# EAGLE design airspeed_drone_2 (EAGLE 7.7.0)
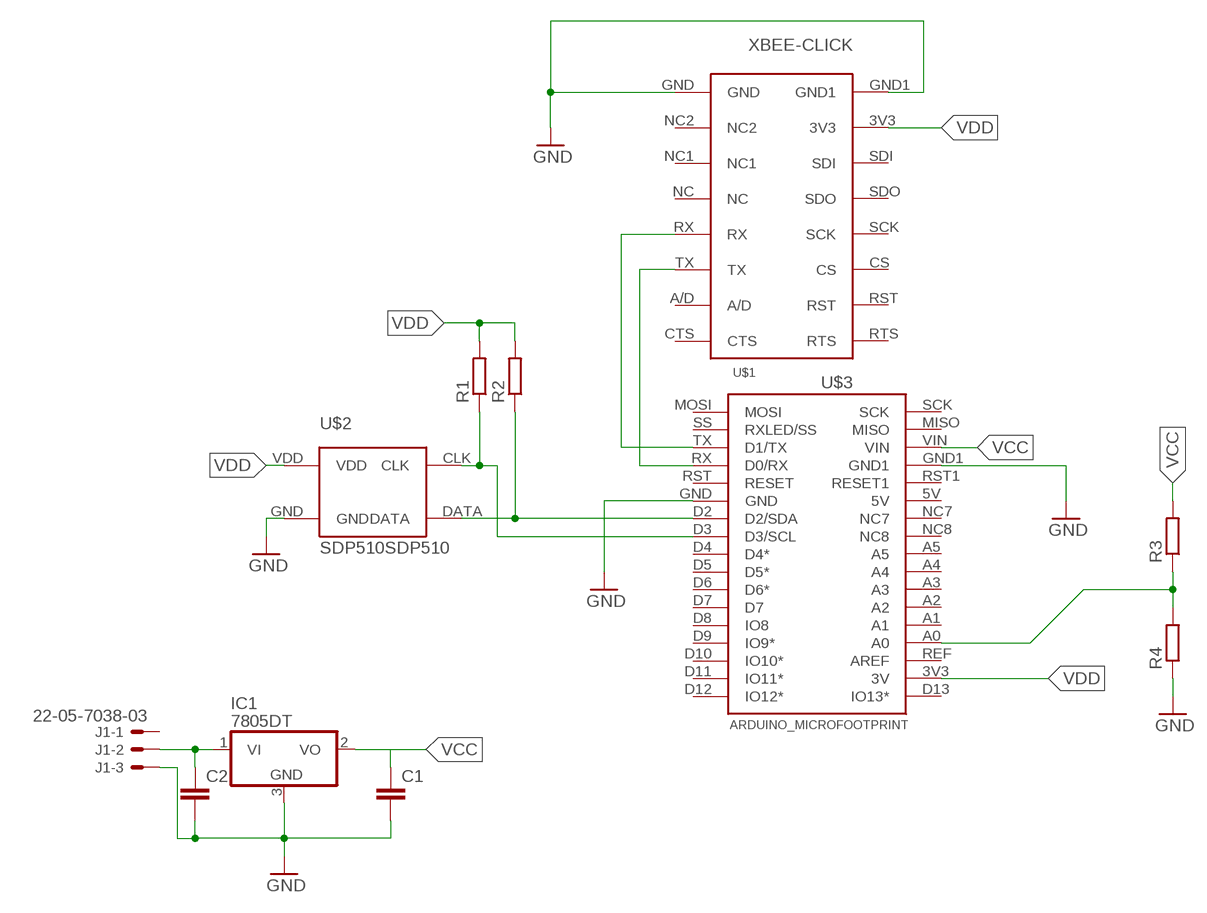
[diagram p0: schematic, sheet 1]

## Parts
C1  C-EUC0805K  [C0805K]
C2  C-EUC0805K  [C0805K]
IC1  7805DT  [TO252]
J1  22-05-7038-03  [7395-03]
R1  R-EU_R0603  [R0603]
R2  R-EU_R0603  [R0603]
R3  R-EU_R0805  [R0805]
R4  R-EU_R0805  [R0805]
U$1  ARDUINO_MICROFOOTPRINT  [ARDUINO-MICRO]
U$2  SDP510SDP510  [SDP510]
U$3  XBEE-CLICK  [XBEE-CLK]

## Nets
GND: C1.2 C2.2 IC1.3(GND) J1.3 R4.1 U$1.GND U$1.GND1 U$2.GND U$3.GND U$3.GND1
N$1: C2.1 IC1.1(VI) J1.2
N$2: R1.1 U$1.D3(D3/SCL) U$2.CLK
N$3: R2.1 U$1.D2(D2/SDA) U$2.DATA
N$4: U$1.RX(D0/RX) U$3.TX
N$5: U$1.TX(D1/TX) U$3.RX
N$7: R3.1 R4.2 U$1.A0
VCC: C1.1 IC1.2(VO) R3.2 U$1.VIN
VDD: R1.2 R2.2 U$1.3V3(3V) U$2.VDD U$3.3V3
Unconnected: J1.1 U$1.5V U$1.A1 U$1.A2 U$1.A3 U$1.A4 U$1.A5 U$1.D4(D4*) U$1.D5(D5*) U$1.D6(D6*) U$1.D7 U$1.D8(IO8) U$1.D9(IO9*) U$1.D10(IO10*) U$1.D11(IO11*) U$1.D12(IO12*) U$1.D13(IO13*) U$1.MISO U$1.MOSI U$1.NC7 U$1.NC8 U$1.REF(AREF) U$1.RST1(RESET1) U$1.RST(RESET) U$1.SCK U$1.SS(RXLED/SS) U$3.A/D U$3.CS U$3.CTS U$3.NC U$3.NC1 U$3.NC2 U$3.RST U$3.RTS U$3.SCK U$3.SDI U$3.SDO

## Library data of the parts
C1 C2 = rcl:C-EU: CAPACITOR, European symbol
IC1 = linear:78*: Positive VOLTAGE REGULATOR Source: http://cache.national.com/ds/LM/LM78L05.pdf http://www.fairchildsemi.com/ds/LM/LM7805.pdf
J1 = con-molex:22-?-03: CONNECTOR wire to board 2.54 mm (.1 inch) pitch header; OC_FARNELL: unknown; OC_NEWARK: unknown
R1 R2 = resistor:R-EU_: RESISTOR, European symbol
R3 R4 = rcl:R-EU_: RESISTOR, European symbol
U$1 = arduino-micro:ARDUINO_MICRO
U$2 = sensirion:SDP510
U$3 = xbee:XBEE-CLICK

## Board
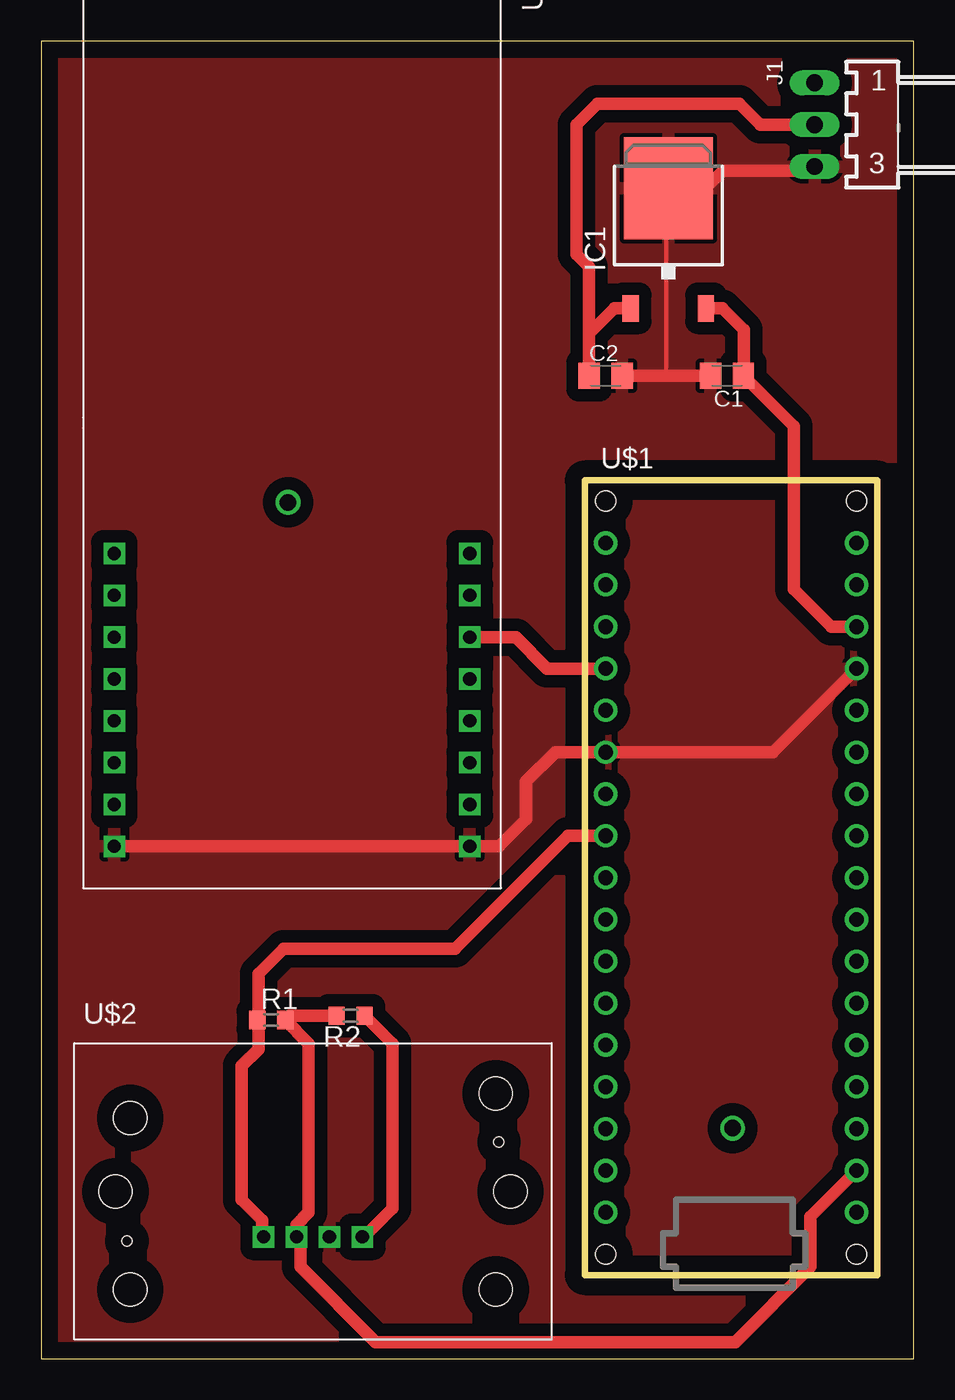
[diagram p1: board, top side]
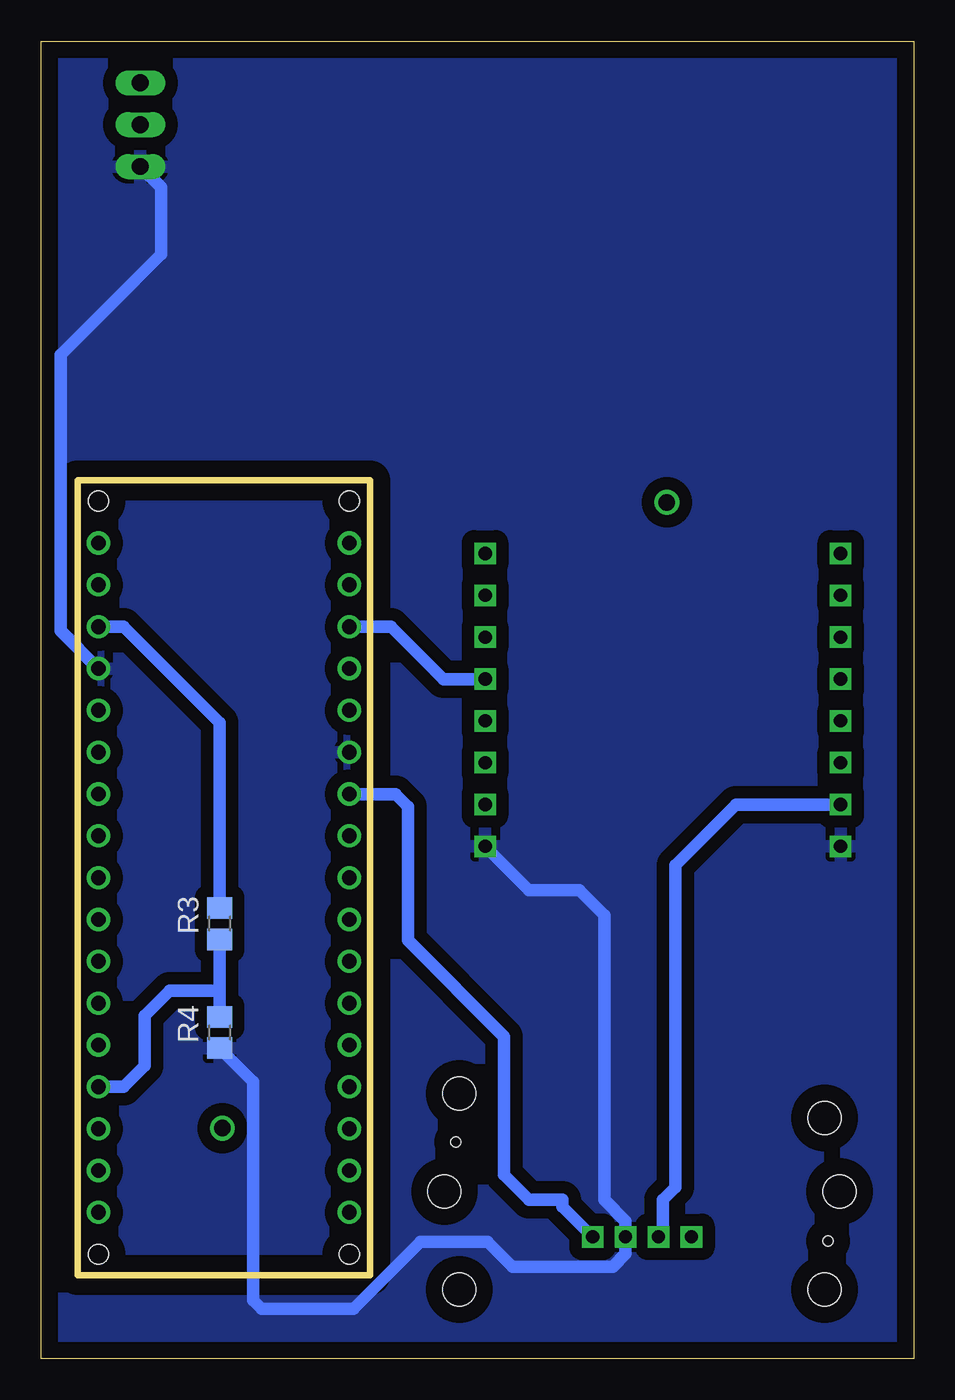
[diagram p2: board, bottom side, seen from below]

Size 53.01 x 80 mm. Coordinates in mm from the lower left corner, seen from the top.
Outline: 0,0 53.01,0 53.01,80 0,80 0,0
Copper layers (1*16): Top 0.035mm / dielectric 1.5mm / Bottom 0.035mm
Design rules "default *": minimum track width 10mil, minimum drill 24mil, track to track 30mil, track to pad 30mil, pad to pad 8mil, via to via 8mil, smd to smd 8mil, copper to edge 40mil, drill to drill 8mil, minimum pad ring 10mil, minimum via ring 8mil, stop-mask expansion 4mil, vias tented up to drill 0mil, thermal gap 10mil

### Footprints (pad centres in the part's own frame; a part is rotated, then mirrored left to right if it is on the bottom)
C0805K = smd 1.3 x 1.6: 1 -1,0; 2 1,0
TO252 = smd 1 x 1.6: 1 -2.28,-4.8; 2 2.28,-4.8 | smd 5.4 x 6.2: 3 0,2.5
7395-03 = drill 1.016 long: 1 2.54,0; 2 0,0; 3 -2.54,0
R0603 = smd 1 x 1.1: 1 -0.85,0; 2 0.85,0
R0805 = smd 1.3 x 1.5: 1 -0.95,0; 2 0.95,0
ARDUINO-MICRO = drill 0.9: 3V3 16.51,3.81; 5V 16.51,29.21; A0 16.51,8.89; A1 16.51,11.43; A2 16.51,13.97; A3 16.51,16.51; A4 16.51,19.05; A5 16.51,21.59; D2 1.27,26.67; D3 1.27,24.13; D4 1.27,21.59; D5 1.27,19.05; D6 1.27,16.51; D7 1.27,13.97; D8 1.27,11.43; D9 1.27,8.89; D10 1.27,6.35; D11 1.27,3.81; D12 1.27,1.27; D13 16.51,1.27; GND 1.27,29.21; GND1 16.51,34.29; MISO 16.51,39.37; MOSI 1.27,41.91; NC7 16.51,26.67; NC8 16.51,24.13; REF 16.51,6.35; RST 1.27,31.75; RST1 16.51,31.75; RX 1.27,34.29; SCK 16.51,41.91; SS 1.27,39.37; TX 1.27,36.83; VIN 16.51,36.83 | hole 1.2: 1.27,-1.27; 16.51,-1.27; 1.27,44.45; 16.51,44.45
SDP510 = drill 0.8 square: CLK -3,-2.75; DATA 3,-2.75; GND 1,-2.75; VDD -1,-2.75 | hole 2: 11.1,5.95; 11.1,-5.95; -11.1,-5.95; -11.1,4.45; 12,0; -12,0 | hole 0.6: 11.3,3; -11.3,-3
XBEE-CLK = drill 0.8 square: 3V3 23.495,-10.795; A/D 10.795,10.795; CS 13.335,-10.795; CTS 8.255,10.795; GND 26.035,-10.795; GND1 26.035,10.795; NC 23.495,10.795; NC1 20.955,10.795; NC2 18.415,10.795; RST 10.795,-10.795; RTS 8.255,-10.795; RX 15.875,10.795; SCK 15.875,-10.795; SDI 20.955,-10.795; SDO 18.415,-10.795; TX 13.335,10.795

### Placement (x,y rotation side)
C1  41.66,59.69 180 top
C2  34.29,59.69 0 top
IC1  38.1,68.58 0 top
J1  46.99,74.93 90 top
R1  13.97,20.57 0 top
R2  18.8,20.83 180 top
R3  42.16,26.42 90 bottom
R4  42.16,19.81 90 bottom
U$1  33.02,7.62 0 top
U$2  16.51,10.16 0 top
U$3  15.24,57.15 270 top

### Tracks (layer width: path | path; a pad name or v marks a point on that pad's centre or on a via)
GND
  Top 0.254: 37.95,59.69 37.95,70.87 IC1.3
  Top 0.762: IC1.3 40.35,71.08 41.4,72.14 46.74,72.14 J1.3 | U$3.GND U$3.GND1 27.81,31.11 29.46,32.77 29.46,35.05 31.24,36.83 U$1.GND 44.45,36.83 U$1.GND1 | C2.2 37.95,59.69 C1.2
  Bottom 0.762: U$3.GND1 23.37,28.45 20.32,28.45 18.8,26.92 18.8,9.65 17.51,8.37 U$2.GND 17.51,6.37 18.29,5.59 24.38,5.59 25.91,7.11 29.97,7.11 34.04,3.05 39.62,3.05 40.13,3.56 40.13,16.83 R4.1 | J1.3 45.72,71.12 45.72,67.06 51.82,60.96 51.82,44.2 U$1.GND1
  pour Bottom: 0.51,0.51 0.51,79.25 52.32,79.25 52.32,77.22 52.32,0.51
  pour Top: 1,1 52,1 52,79 1,79 1,77
N$1
  Top 0.762: IC1.1 34.82,63.78 33.27,62.23 | 33.27,62.23 33.27,61.72 33.27,59.71 C2.1 | J1.2 43.69,74.93 42.42,76.2 33.78,76.2 32.51,74.93 32.51,67.06 33.27,66.29 33.27,62.23
N$2
  Top 0.762: U$2.CLK 13.42,7.41 13.42,8.43 12.19,9.65 12.19,17.78 13.21,18.8 13.21,20.49 R1.1 13.21,20.66 13.21,23.37 14.73,24.89 25.15,24.89 32,31.75 U$1.D3
N$3
  Top 0.762: U$2.DATA 19.6,7.41 21.34,9.14 21.34,19.14 R2.1
  Bottom 0.762: U$1.D2 31.5,34.29 30.73,33.53 30.73,25.4 24.89,19.56 24.89,11.18 23.37,9.65 21.34,9.65 21.34,9.24 U$2.DATA
N$4
  Top 0.762: U$3.TX 28.83,43.81 30.73,41.91 U$1.RX
N$5
  Bottom 0.762: U$3.RX 28.57,41.27 31.75,44.45 U$1.TX
N$6  (via drill 1)
  other vias: 15,52
N$7
  Bottom 0.762: R4.2 42.16,22.35 | 42.16,22.35 R3.1 | U$1.A0 48.01,16.51 46.74,17.78 46.74,20.83 45.21,22.35 42.16,22.35
N$8  (via drill 1)
  other vias: 42,14
VCC
  Top 0.762: IC1.2 41.38,63.78 42.67,62.48 42.67,59.71 C1.1 45.72,56.63 45.72,46.74 48.01,44.45 U$1.VIN
  Bottom 0.762: R3.2 42.16,38.61 48.01,44.45 U$1.VIN
VDD
  Top 0.762: R2.2 15.07,20.83 R1.2 16.26,19.14 16.26,8.89 15.51,8.14 U$2.VDD 15.75,7.17 15.75,5.59 20.32,1.02 42.16,1.02 46.74,5.59 46.74,8.64 U$1.3V3
  Bottom 0.762: U$3.3V3 10.79,33.66 14.48,29.97 14.48,10.41 15.24,9.65 15.24,7.68 U$2.VDD